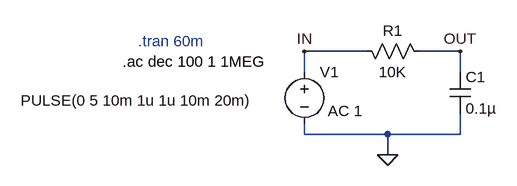
[diagram p0: schematic AC_Analysis.asc]
AC_Analysis.asc, the LTspice schematic file:
Version 4.1
SHEET 1 880 680
WIRE 176 96 80 96
WIRE 320 96 256 96
WIRE 80 128 80 96
WIRE 320 128 320 96
WIRE 80 224 80 208
WIRE 208 224 80 224
WIRE 320 224 320 192
WIRE 320 224 208 224
WIRE 208 256 208 224
FLAG 208 256 0
FLAG 80 96 IN
FLAG 320 96 OUT
SYMBOL voltage 80 112 R0
WINDOW 3 -437 60 Left 2
WINDOW 123 36 76 Left 2
WINDOW 39 0 0 Left 0
SYMATTR Value PULSE(0 5 10m 1u 1u 10m 20m)
SYMATTR Value2 AC 1
SYMATTR InstName V1
SYMBOL res 160 80 M90
WINDOW 0 0 56 VBottom 2
WINDOW 3 32 56 VTop 2
SYMATTR InstName R1
SYMATTR Value 10K
SYMBOL cap 304 128 R0
SYMATTR InstName C1
SYMATTR Value 0.1µ
TEXT -176 80 Left 2 ;.tran 60m
TEXT -200 112 Left 2 !.ac dec 100 1 1MEG

The netlist it stands for:
* AC_Analysis.asc
V1 IN 0 PULSE(0 5 10m 1u 1u 10m 20m) AC 1
R1 IN OUT 10K
C1 OUT 0 0.1µ
* .tran 60m
.ac dec 100 1 1MEG
.backanno
.end